# EAGLE design TSAL Proto18_rev3 (EAGLE 6.5.0)
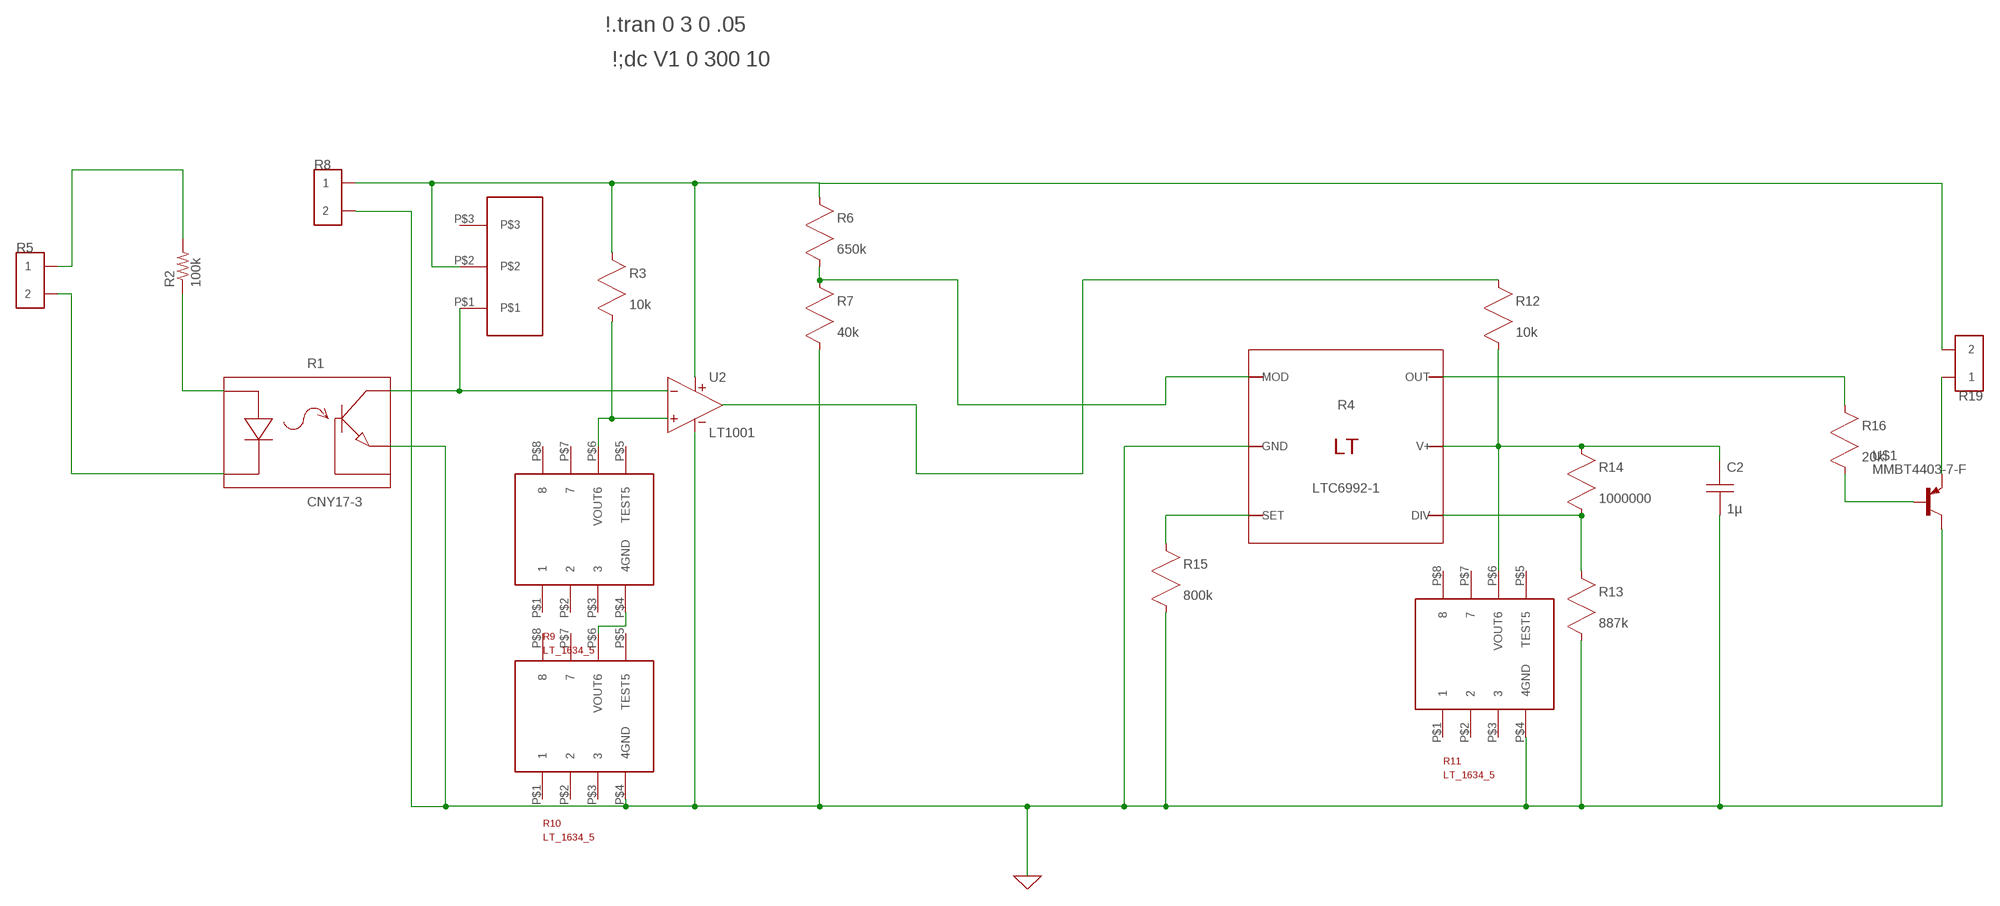
[diagram p0: schematic, sheet 1]

## Parts
C2  1µ  CAP  [C0805]
R1  CNY17-3  [CNY17-3]
R2  100k  R-US_0817/22  [P0817/22]
R3  10k  RES  [R0805]
R4  LTC6992-1  [LTC6992-1]
R5  CONN_2  [CONNECTOR_2]
R6  650k  RES  [R0805]
R7  40k  RES  [R0805]
R8  CONN_2  [CONNECTOR_2]
R9  LT_1634_5MS8  [LT_1634_5]
R10  LT_1634_5MS8  [LT_1634_5]
R11  LT_1634_5MS8  [LT_1634_5]
R12  10k  RES  [R0805]
R13  887k  RES  [R0805]
R14  1000000  RES  [R0805]
R15  800k  RES  [R0805]
R16  20k  RES  [R0805]
R19  CONN_2  [CONNECTOR_2]
U2  LT1001  [S8]
U$1  MMBT4403-7-F  [SOT-23-3]
U$2  RK097111T  [RK097-POTENTIOMETER]

## Nets
0: C2.2(B) R1.P$4(E) R4.P$2(GND) R7.2(B) R8.3 R8.4 R10.P$4(4GND) R11.P$4(4GND) R13.2(B) R15.2(B) U2.4(V-) U$1.P$1(C)
N$1: R2.2 R5.1 R5.2
N$2: R1.P$2(K) R5.3 R5.4
N$3: R9.P$4(4GND) R10.P$6(VOUT6)
N$4: R3.1(A) R6.1(A) R8.1 R8.2 R19.3 R19.4 U2.8(V+) U$2.P$2
N$5: R16.2(B) U$1.P$2(B)
N$6: R12.1(A) U2.3(OUT)
N$7: R4.P$1(MOD) R6.2(B) R7.1(A)
N$8: R4.P$6(OUT) R16.1(A)
N$9: R1.P$1(A) R2.1
N$10: R1.P$5(C) U2.2(IN-) U$2.P$1
N$12: R3.2(B) R9.P$6(VOUT6) U2.1(IN+)
N$13: R19.1 R19.2 U$1.P$3(E)
N$15: C2.1(A) R4.P$5(V+) R11.P$6(VOUT6) R12.2(B) R14.1(A)
N$18: R4.P$3(SET) R15.1(A)
N$19: R4.P$4(DIV) R13.1(A) R14.2(B)
Unconnected: R1.P$6(B) R9.P$1 R9.P$2 R9.P$3 R9.P$5(TEST5) R9.P$7 R9.P$8 R10.P$1 R10.P$2 R10.P$3 R10.P$5(TEST5) R10.P$7 R10.P$8 R11.P$1 R11.P$2 R11.P$3 R11.P$5(TEST5) R11.P$7 R11.P$8 U$2.P$3

## Notes on the sheet
- \!.tran 0 3 0 .05
- \!;dc V1 0 300 10

## Library data of the parts
C2 = sym:CAP: Capacitor
R1 = FE_Kenny:CNY17-3
R2 = resistor:R-US_: RESISTOR, American symbol
R3 R6 R7 R12-R16 = sym:RES: A resistor
R4 = FE_Kenny:LTC6992-1
R5 R8 R19 = formula electric:CONN_2
R9-R11 = FE_Kenny:LT_1634_5
U2 = Opamps:LT1001: Precision Operational Amplifier
U$1 = formula electric:MMBT4403-7-F
U$2 = FE_Kenny:RK097111T

## Board
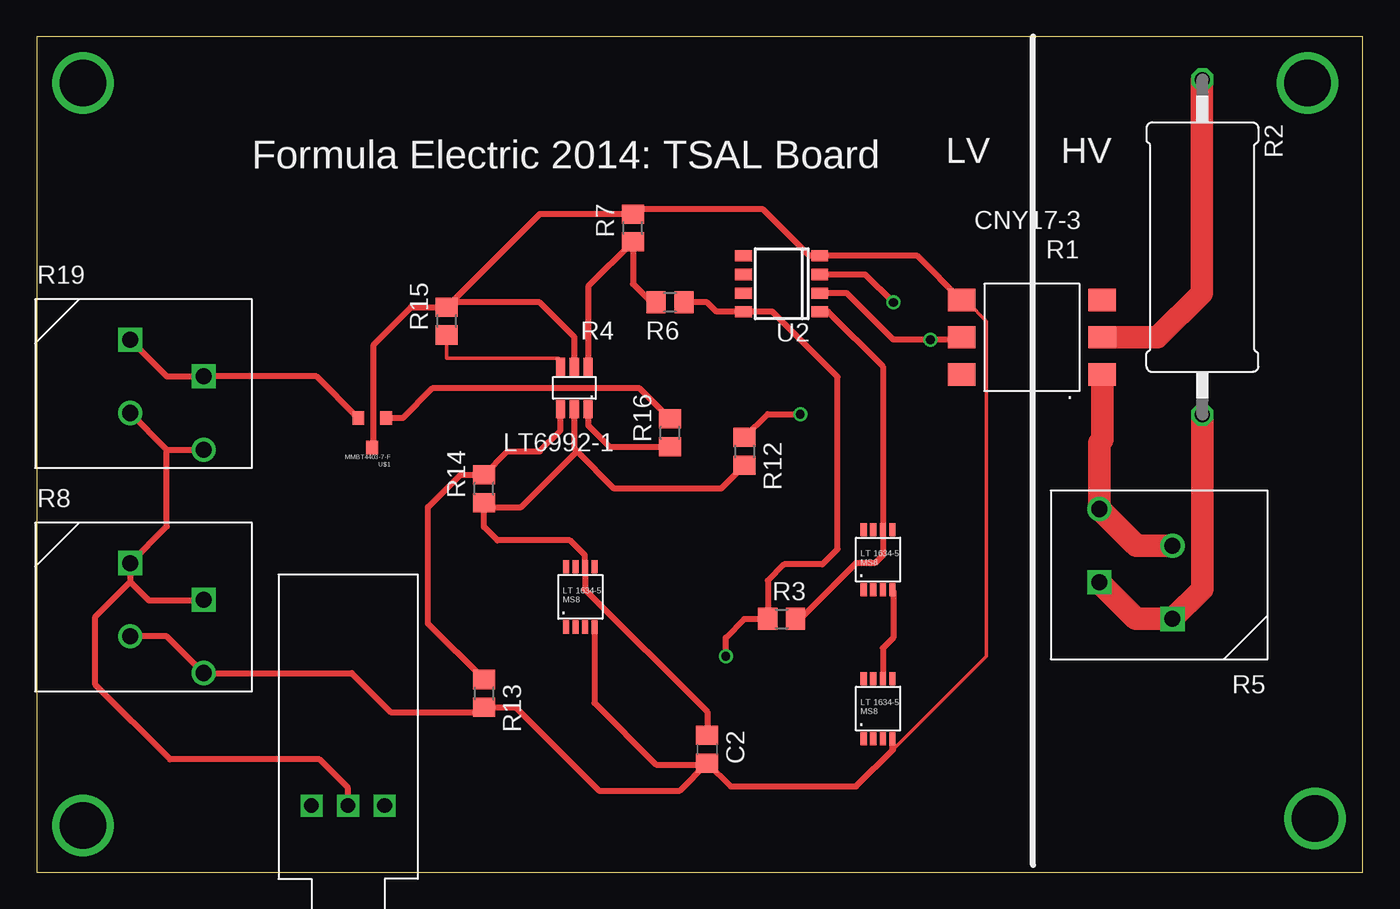
[diagram p1: board, top side]
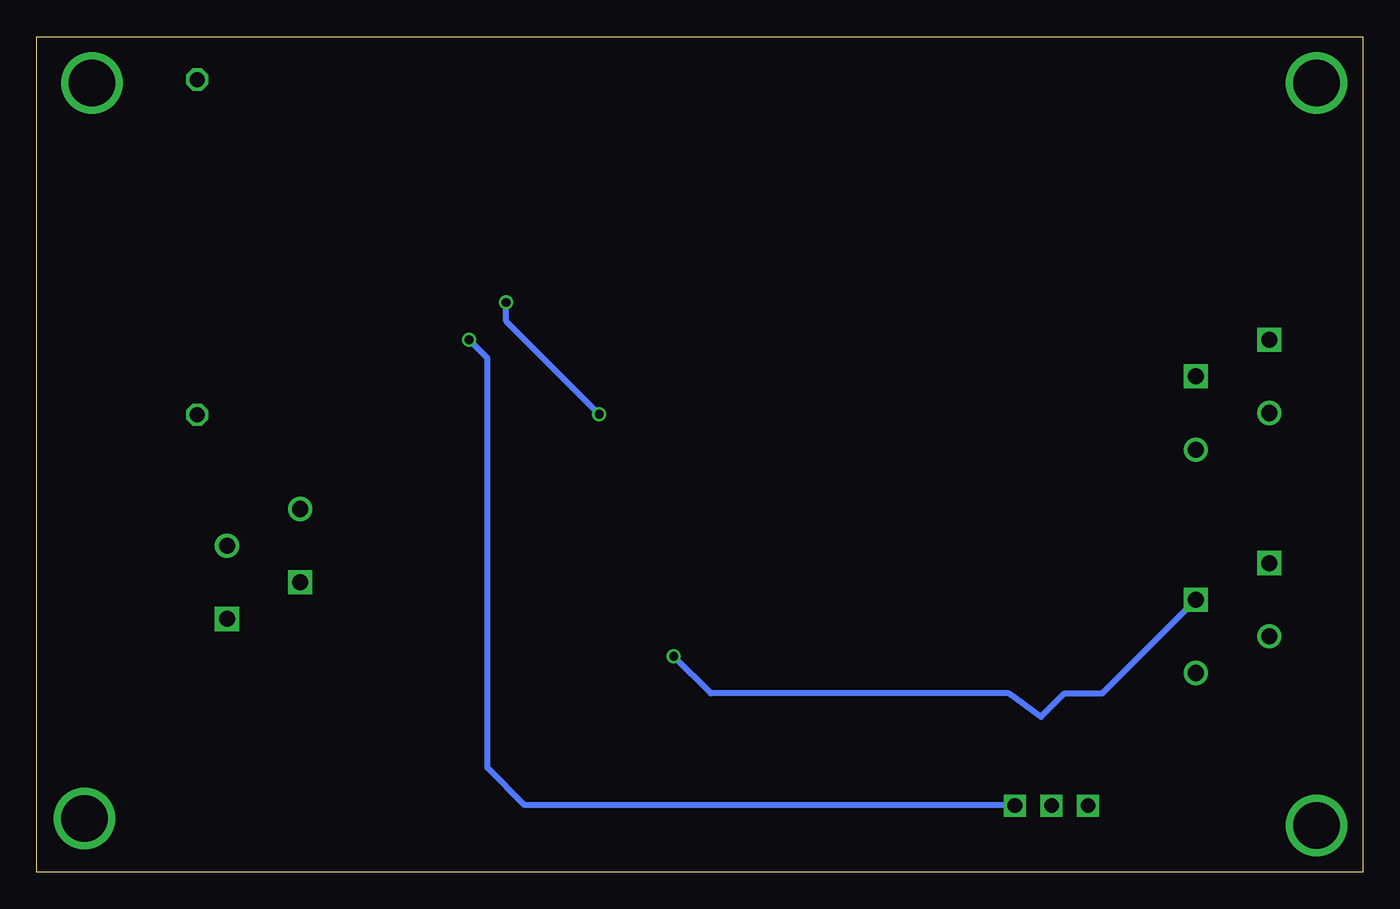
[diagram p2: board, bottom side, seen from below]

Size 90.5 x 57 mm. Coordinates in mm from the lower left corner, seen from the top.
Outline: 0,0 90.5,0 90.5,57 0,57 0,0
Copper layers (1*16): Top 0.0356mm / dielectric 1.5011mm / Bottom 0.0356mm
Design rules "OshPark DRC": minimum track width 6mil, minimum drill 13mil, track to track 6mil, track to pad 6mil, pad to pad 6mil, via to via 6mil, smd to smd 6mil, copper to edge 15mil, drill to drill 6mil, minimum pad ring 7mil, minimum via ring 7mil, stop-mask expansion 3mil, vias tented up to drill 0mil, thermal gap 10mil

### Footprints (pad centres in the part's own frame; a part is rotated, then mirrored left to right if it is on the bottom)
C0805 = smd 1.3 x 1.5: 1 -0.95,0; 2 0.95,0
CNY17-3 = smd 1.88 x 1.52: P$1 -1.55,3.65; P$2 -1.55,6.19; P$3 -1.55,1.11; P$4 8.05,1.11; P$5 8.05,3.65; P$6 8.05,6.19
P0817/22 = drill 1.016 octagon: 1 -11.43,0; 2 11.43,0
R0805 = smd 1.3 x 1.5: 1 -0.95,0; 2 0.95,0
LTC6992-1 = smd 0.62 x 1.22: P$1 0.5,-0.7; P$2 1.45,-0.7; P$3 2.4,-0.7; P$4 2.4,2.2; P$5 1.45,2.2; P$6 0.5,2.2
CONNECTOR_2 = drill 1.1 square: 1 0,0; 2 2.5,5 | drill 1.1: 3 5,0; 4 7.5,5
LT_1634_5 = smd 0.42 x 0.9: P$1 0.52,-0.55; P$2 1.17,-0.55; P$3 1.82,-0.55; P$4 2.47,-0.55; P$5 2.47,3.55; P$6 1.82,3.55; P$7 1.17,3.55; P$8 0.52,3.55
S8 = smd 0.762 x 1.143: 1 -1.905,-2.6; 2 -0.635,-2.6; 3 0.635,-2.6; 4 1.905,-2.6; 5 1.905,2.6; 6 0.635,2.6; 7 -0.635,2.6; 8 -1.905,2.6
SOT-23-3 = smd 0.8 x 0.9: P$1 0,1; P$2 -0.95,-1; P$3 0.95,-1
RK097-POTENTIOMETER = drill 1 square: P$1 2.25,15.75; P$2 4.75,15.75; P$3 7.25,15.75

### Placement (x,y rotation side)
C2  45.76,8.39 270 top
R1  71.16,40.14 180 top
R2  79.55,42.64 270 top
R3  50.84,17.28 0 top
R4  38.14,33.79 180 top
R5  77.51,17.28 90 top
R6  43.22,38.87 180 top
R7  40.68,43.95 90 top
R8  6.39,21.09 270 top
R9  55.92,19.82 0 top
R10  55.92,9.66 0 top
R11  35.6,17.28 0 top
R12  48.3,28.71 270 top
R13  30.52,12.2 270 top
R14  30.52,26.17 90 top
R15  27.98,37.6 90 top
R16  43.22,29.98 90 top
R19  6.39,36.33 270 top
U2  50.84,40.14 90 top
U$1  22.9,29.98 180 top
U$2  26,20.3 180 top

### Tracks (layer width: path | path; a pad name or v marks a point on that pad's centre or on a via)
0
  Top 0.254: 58.46,8.39 64.81,14.74 64.81,37.6 63.54,38.87 R1.P$4 | 40.68,45.22 R7.2
  Top 0.406: C2.2 47.35,5.85 55.92,5.85 58.46,8.39 58.39,8.46 R10.P$4 | R1.P$4 60.09,42.05 U2.4 52.74,42.05 49.57,45.22 41,45.22 R7.2 34.33,44.9 R15.2 | R13.2 30.2,10.93 24.17,10.93 21.51,13.59 R8.4 8.89,16.09 R8.3 | R4.P$2 36.69,36.51 34.33,38.87 28.3,38.87 R15.2 | 30.52,10.93 R13.2 | R13.2 32.68,11.25 38.36,5.57 43.89,5.57 C2.2 | R11.P$4 38.07,11.55 42.28,7.34 45.66,7.34 C2.2 | U$1.P$1 23,29.08 23,36 25.55,38.55 R15.2
N$1
  Top 1.52: R5.2 75.01,17.28 R5.1 79.55,19.32 R2.2
N$2
  Top 0.406: 75.05,22.28 74.97,22.36 74.93,22.36 | 72.51,29.3 72.71,29.5
  Top 1.52: R5.3 75.05,22.28 | 74.93,22.36 R5.4 72.51,29.3 | R1.P$2 72.71,29.5
N$3
  Top 0.406: R9.P$4 58.46,19.2 58.46,16.01 57.74,15.29 R10.P$6
N$4  (via drill 0.6)
  Top 0.406: 6.39,19.82 R8.1 8.89,23.59 8.89,28.83 | 6.39,19.82 7.66,18.55 11.35,18.55 R8.2 | v47.03,14.74 47.03,16.01 48.3,17.28 R3.1 49.89,19.89 51,21 53.61,21 54.65,22.04 54.65,33.79 50.2,38.23 U2.8 46.4,38.23 45.76,38.87 R6.1 | R19.3 8.89,28.83 | 8.89,28.83 R19.4 | U$2.P$2 21.25,5.75 19.3,7.7 9.1,7.7 4,12.8 4,17.43 6.39,19.82
  Bottom 0.406: R8.2 17.78,12.2 20.36,12.2 21.96,10.6 24.17,12.2 44.49,12.2 v47.03,14.74
N$5
  Top 0.406: R16.2 41.15,33 27,33 24.98,30.98 U$1.P$2
N$6  (via drill 0.6)
  Top 0.406: R12.1 49.89,31.25 v52.11,31.25 | v58.46,38.87 56.55,40.77 U2.3
  Bottom 0.406: v52.11,31.25 58.46,37.6 v58.46,38.87
N$7
  Top 0.406: R4.P$1 37.64,39.96 R7.1 40.68,40.14 41.95,38.87 R6.2
N$8
  Top 0.406: R4.P$6 37.64,30.48 39.09,29.03 R16.1
N$9
  Top 0.406: 79.5,54.02 R2.1
  Top 1.52: R1.P$1 76.49,36.49 79.5,39.5 79.5,54.02
N$10  (via drill 0.6)
  Top 0.406: R1.P$5 62.95,36.33 v61,36.33 58.46,36.33 55.28,39.51 U2.2
  Bottom 0.406: v61,36.33 59.73,35.06 59.73,7.12 57.19,4.58 23.78,4.58 U$2.P$1
N$12
  Top 0.406: U2.1 54.02,38.23 57.74,34.51 R9.P$6 57.74,21.64 57.19,21.09 55.92,21.09 52.11,17.28 R3.2
N$13
  Top 0.406: R19.1 8.89,33.83 R19.2 19.1,33.83 U$1.P$3
N$14  (via drill 3.17)
  other vias: 3.17,53.83
N$15
  Top 0.406: 36.87,28.71 33.06,24.9 30.84,24.9 R14.1 30.52,23.56 31.44,22.64 36.4,22.64 37.42,21.61 R11.P$6 37.42,19.27 45.76,10.93 C2.1 | 36.87,28.71 36.69,28.89 R4.P$5 | 36.87,28.71 39.41,26.17 46.71,26.17 R12.2
N$16  (via drill 3.17)
  other vias: 86.72,53.83
N$17  (via drill 3.17)
  other vias: 87.22,3.67
N$18
  Top 0.254: R15.1 27.98,35.06 35.6,35.06 R4.P$3
N$19
  Top 0.406: R13.1 26.71,16.96 26.71,24.9 28.93,27.12 R14.2 32.11,28.71 34.33,28.71 35.74,30.12 R4.P$4
N$20  (via drill 3.17)
  other vias: 3.17,3.17

### Text on the board
tNames: Formula Electric 2014: TSAL Board | LV | HV